# Altium schematic sheet CHARGERSDC23-ESF.SchDoc
size A4
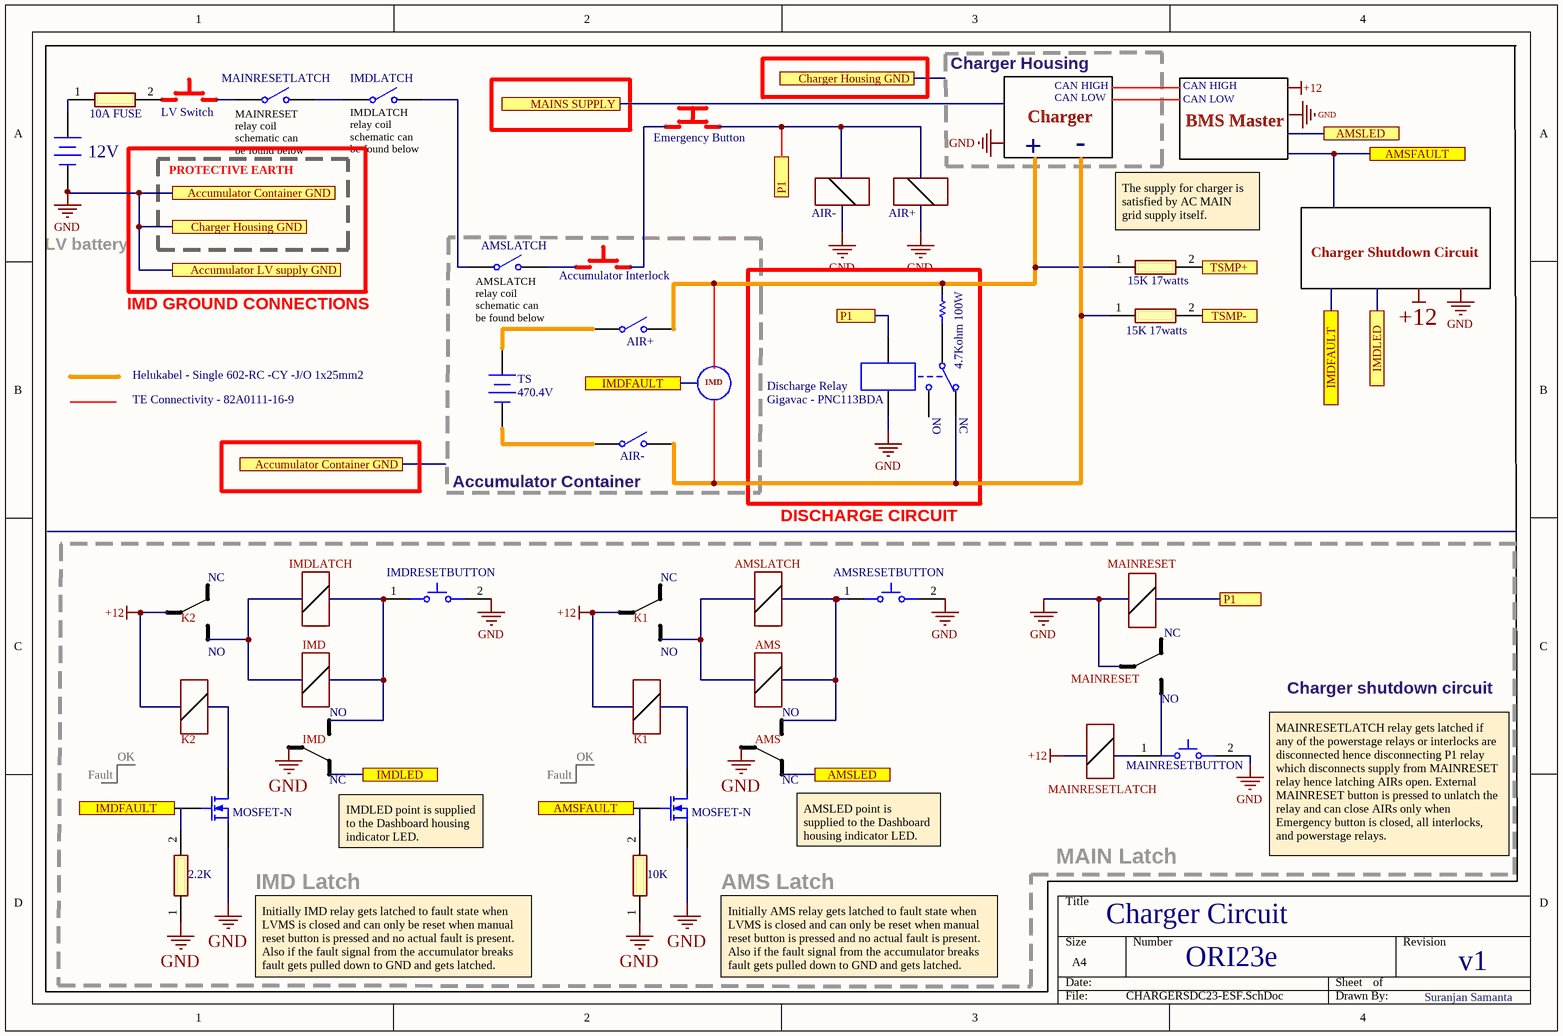
[diagram p0: CHARGERSDC23-ESF.SchDoc]

## Parts
(Parts that share a designator on the sheet are numbered #1, #2 ... from top to bottom, then left to right.)
12V  Battery  [BAT-2]  (value not drawn)
?#1  Discharge Relay  [MODULE5B]
?#2  MOSFET-N  [E3]
?#3  MOSFET-N  [E3]
AMSRESETBUTTON  (no value)  [OMRON-B3U-1000_V]
IMDRESETBUTTON  (no value)  [OMRON-B3U-1000_V]
MAINRESETBUTTON  (no value)  [OMRON-B3U-1000_V]
R?#1  10A FUSE  [RESC0603X28N]
R?#2  15K 17watts  [RESC0603X28N]
R?#3  15K 17watts  [RESC0603X28N]
R?#4  4.7Kohm 100W  [AXIAL-0.3]
R?#5  2.2K  [RESC0603X28N]
R?#6  10K  [RESC0603X28N]
S?#1  MAINRESETLATCH  [SPST-2]
S?#2  IMDLATCH  [SPST-2]
S?#3  AMSLATCH  [SPST-2]
S?#4  AIR+  [SPST-2]
S?#5  AIR-  [SPST-2]
TS  470.4V  [BAT-2]

## Ports
Accumulator Container GND, Accumulator LV supply GND, AMSFAULT, AMSLED, Charger Housing GND, IMDFAULT, IMDLED, MAINS SUPPLY, P1, TSMP+, TSMP-

## Nets
GND: 12V.2(-) ?#1.5 ?#2.3(S) ?#3.3(S) AMSRESETBUTTON.2 IMDRESETBUTTON.2 MAINRESETBUTTON.2 R?#5.1 R?#6.1 ; port Accumulator Container GND, port Charger Housing GND, port Accumulator LV supply GND
AMSFAULT: ?#3.2(G) ; port AMSFAULT
IMDFAULT: ?#2.2(G) ; port IMDFAULT
P1: ?#1.4 ; port P1
TSMP+: R?#2.2 ; port TSMP+
TSMP-: R?#3.2 ; port TSMP-
Net12V_1: 12V.1(+) R?#1.1
Net?#1_1: ?#1.1 R?#4.1
Net?#1_2: ?#1.2 R?#3.1 S?#5.2(NO)
NetR?#2_1: R?#2.1 S?#4.2(NO)
NetS?#1_2: S?#1.2(NO) S?#2.1(COMMON)
NetS?#2_2: S?#2.2(NO) S?#3.1(COMMON)
NetS?#4_1: S?#4.1(COMMON) TS.1(+)
NetS?#5_1: S?#5.1(COMMON) TS.2(-)

Not connected (* = marked no-connect by the designer): ?#1 3; ?#2 1(D); ?#3 1(D); AMSRESETBUTTON 1; IMDRESETBUTTON 1; MAINRESETBUTTON 1; R?#1 2; R?#4 2; R?#5 2; R?#6 2; S?#1 1(COMMON); S?#3 2(NO)

## Notes on the sheet
- (near R?#1) LV Switch
- Charger Housing
- CAN HIGH
- CAN LOW
- PROTECTIVE EARTH
- (near S?#1) MAINRESET relay coil schematic can be found below
- (near S?#2) IMDLATCH relay coil schematic can be found below
- Emergency Button
- Charger
- +
- -
- BMS Master
- LV battery
- AIR-
- AIR+
- (near R?#2) The supply for charger is satisfied by AC MAIN grid supply itself.
- IMD GROUND CONNECTIONS
- (near S?#3) AMSLATCH relay coil schematic can be found below
- (near S?#3) Accumulator Interlock
- Charger Shutdown Circuit
- Helukabel - Single 602-RC -CY -J/O 1x25mm2
- IMD
- TE Connectivity - 82A0111-16-9
- (near ?#1) Gigavac - PNC113BDA
- (near ?#1) NO
- (near ?#1) NC
- (near S?#5) Accumulator Container
- NC
- IMDLATCH
- AMSLATCH
- DISCHARGE CIRCUIT
- MAINRESET
- K2
- NO
- K1
- AMS
- (near MAINRESETBUTTON) NO
- Charger shutdown circuit
- Fault
- OK
- (near ?#2) K2
- (near ?#3) K1
- IMDLED point is supplied to the Dashboard housing indicator LED.
- AMSLED point is supplied to the Dashboard housing indicator LED.
- (near MAINRESETBUTTON) MAINRESETLATCH
- MAINRESETLATCH relay gets latched if any of the powerstage relays or interlocks are disconnected hence disconnecting P1 relay which disconnects supply from MAINRESET relay hence latching AIRs open. External MAINRESET button is pressed to unlatch the relay and can close AIRs only when Emergency button is closed, all interlocks, and powerstage relays.
- IMD Latch
- AMS Latch
- MAIN Latch
- Initially IMD relay gets latched to fault state when LVMS is closed and can only be reset when manual reset button is pressed and no actual fault is present. Also if the fault signal from the accumulator breaks fault gets pulled down to GND and gets latched.
- Initially AMS relay gets latched to fault state when LVMS is closed and can only be reset when manual reset button is pressed and no actual fault is present. Also if the fault signal from the accumulator breaks fault gets pulled down to GND and gets latched.
- Charger Circuit
- ORI23e
- v1
- Suranjan Samanta
- Labels drawn without touching a wire or pin: +12, GND

## Library data of the parts
12V TS = Battery: Multicell Battery; Published: 24-Mar-1999; LatestRevisionDate: 17-Jul-2002; LatestRevisionNote: Re-released for DXP Platform.; PackageReference: BAT-2; Publisher: Altium Limited; PackageDescription: Battery; 2 Leads
?#1 = Relay-SPDT: Single-Pole Dual-Throw Relay; Published: 24-Mar-1999; LatestRevisionDate: 17-Jul-2002; LatestRevisionNote: Re-released for DXP Platform.; PackageReference: MODULE5B; Publisher: Altium Limited
?#2 ?#3 = MOSFET-N: N-Channel MOSFET; Published: 8-Jun-2000; LatestRevisionDate: 17-Jul-2002; LatestRevisionNote: Re-released for DXP Platform.; PackageVersion: 1995/1996; PackageReference: E3; Publisher: Altium Limited; PackageDescription: TO, Flat Index; 3 In-Line, Axial Leads; Body Dia. 4.6mm; Lead Dia. 0.5 mm (max)
AMSRESETBUTTON IMDRESETBUTTON MAINRESETBUTTON = CMP-2100-03586-1: Ultra-Small Tactile Switch, 0.05 A, 12 V, -25 to 70 degC, 2-Pin SMD, RoHS, Tape and Reel; Manufacturer: Omron Electronic Components; Operating Force: 1.5N; Current Rating: 50mA; Voltage Rating (DC): 12V; Electrical Life: 200000Cycles; Actuator Length: 0.4mm; Insulation Resistance: 100MOhm; Switch Travel: 0.15mm; Throw Configuration: SPST; Illumination Type: Illuminated; Width: 3mm; Weight: 0.022g; Datasheet Version: 42005.0; Datasheet URL: http://www.omron.com/ecb/products/pdf/en-b3u.pdf; Height: 1.2mm; Package Quantity: 1; REACH SVHC: Unknown; Contact Current Rating: 50mA; Contact Material: Silver; Max Current Rating: 50mA; Package Reference: B3U-1000; Termination: SMD/SMT; Packaging: TapeandReel; Manufacturer URL: http://www.omron.com/; RoHSCompliant: true; Mount: SurfaceMount; Length: 4mm; Min Operating Temperature: -25degC; Depth: 2.5mm; Lead Free: LeadFree; Case/Package: SMD/SMT; Package Description: 2-Pin Surface Mount Device, Body 3 x 2.5 mm; Max Operating Temperature: 70degC; Orientation: Straight
R?#1-R?#3 R?#5 R?#6 = CPF0201D100RE1: Resistor; Manufacturer_Name: TE Connectivity; Datasheet Link: http://www.te.com/commerce/DocumentDelivery/DDEController?Action=showdoc&DocId=Data+Sheet%7F1773200-1%7FA%7Fpdf%7FEnglish%7FENG_DS_1773200-1_A.pdf%7F4-2176215-6; Height: 0.28mm; Manufacturer_Part_Number: CPF0201D100RE1; Mouser Part Number: 279-CPF0201D100RE1; Mouser Price/Stock: https://www.mouser.com/Search/Refine.aspx?Keyword=279-CPF0201D100RE1; RS Part Number: 7549192; RS Price/Stock: http://uk.rs-online.com/web/p/products/7549192
R?#4 = Res1: Resistor; Value: 1K; Published: 8-Jun-2000; LatestRevisionDate: 17-Jul-2002; LatestRevisionNote: Re-released for DXP Platform.; PackageReference: AXIAL-0.3; Publisher: Altium Limited; PackageDescription: Axial Device, Thru-Hole; 2 Leads; 0.3 in Pin Spacing
S?#1-S?#5 = SW-SPST: Single-Pole, Single-Throw Switch; Published: 24-Mar-1999; LatestRevisionDate: 17-Jul-2002; LatestRevisionNote: Re-released for DXP Platform.; PackageReference: SPST-2; Publisher: Altium Limited; PackageDescription: Switch; 2 Leads